# Altium schematic sheet Ethernet_PHY.SchDoc
size A2; SheetNumber: 11; SheetTotal: 14
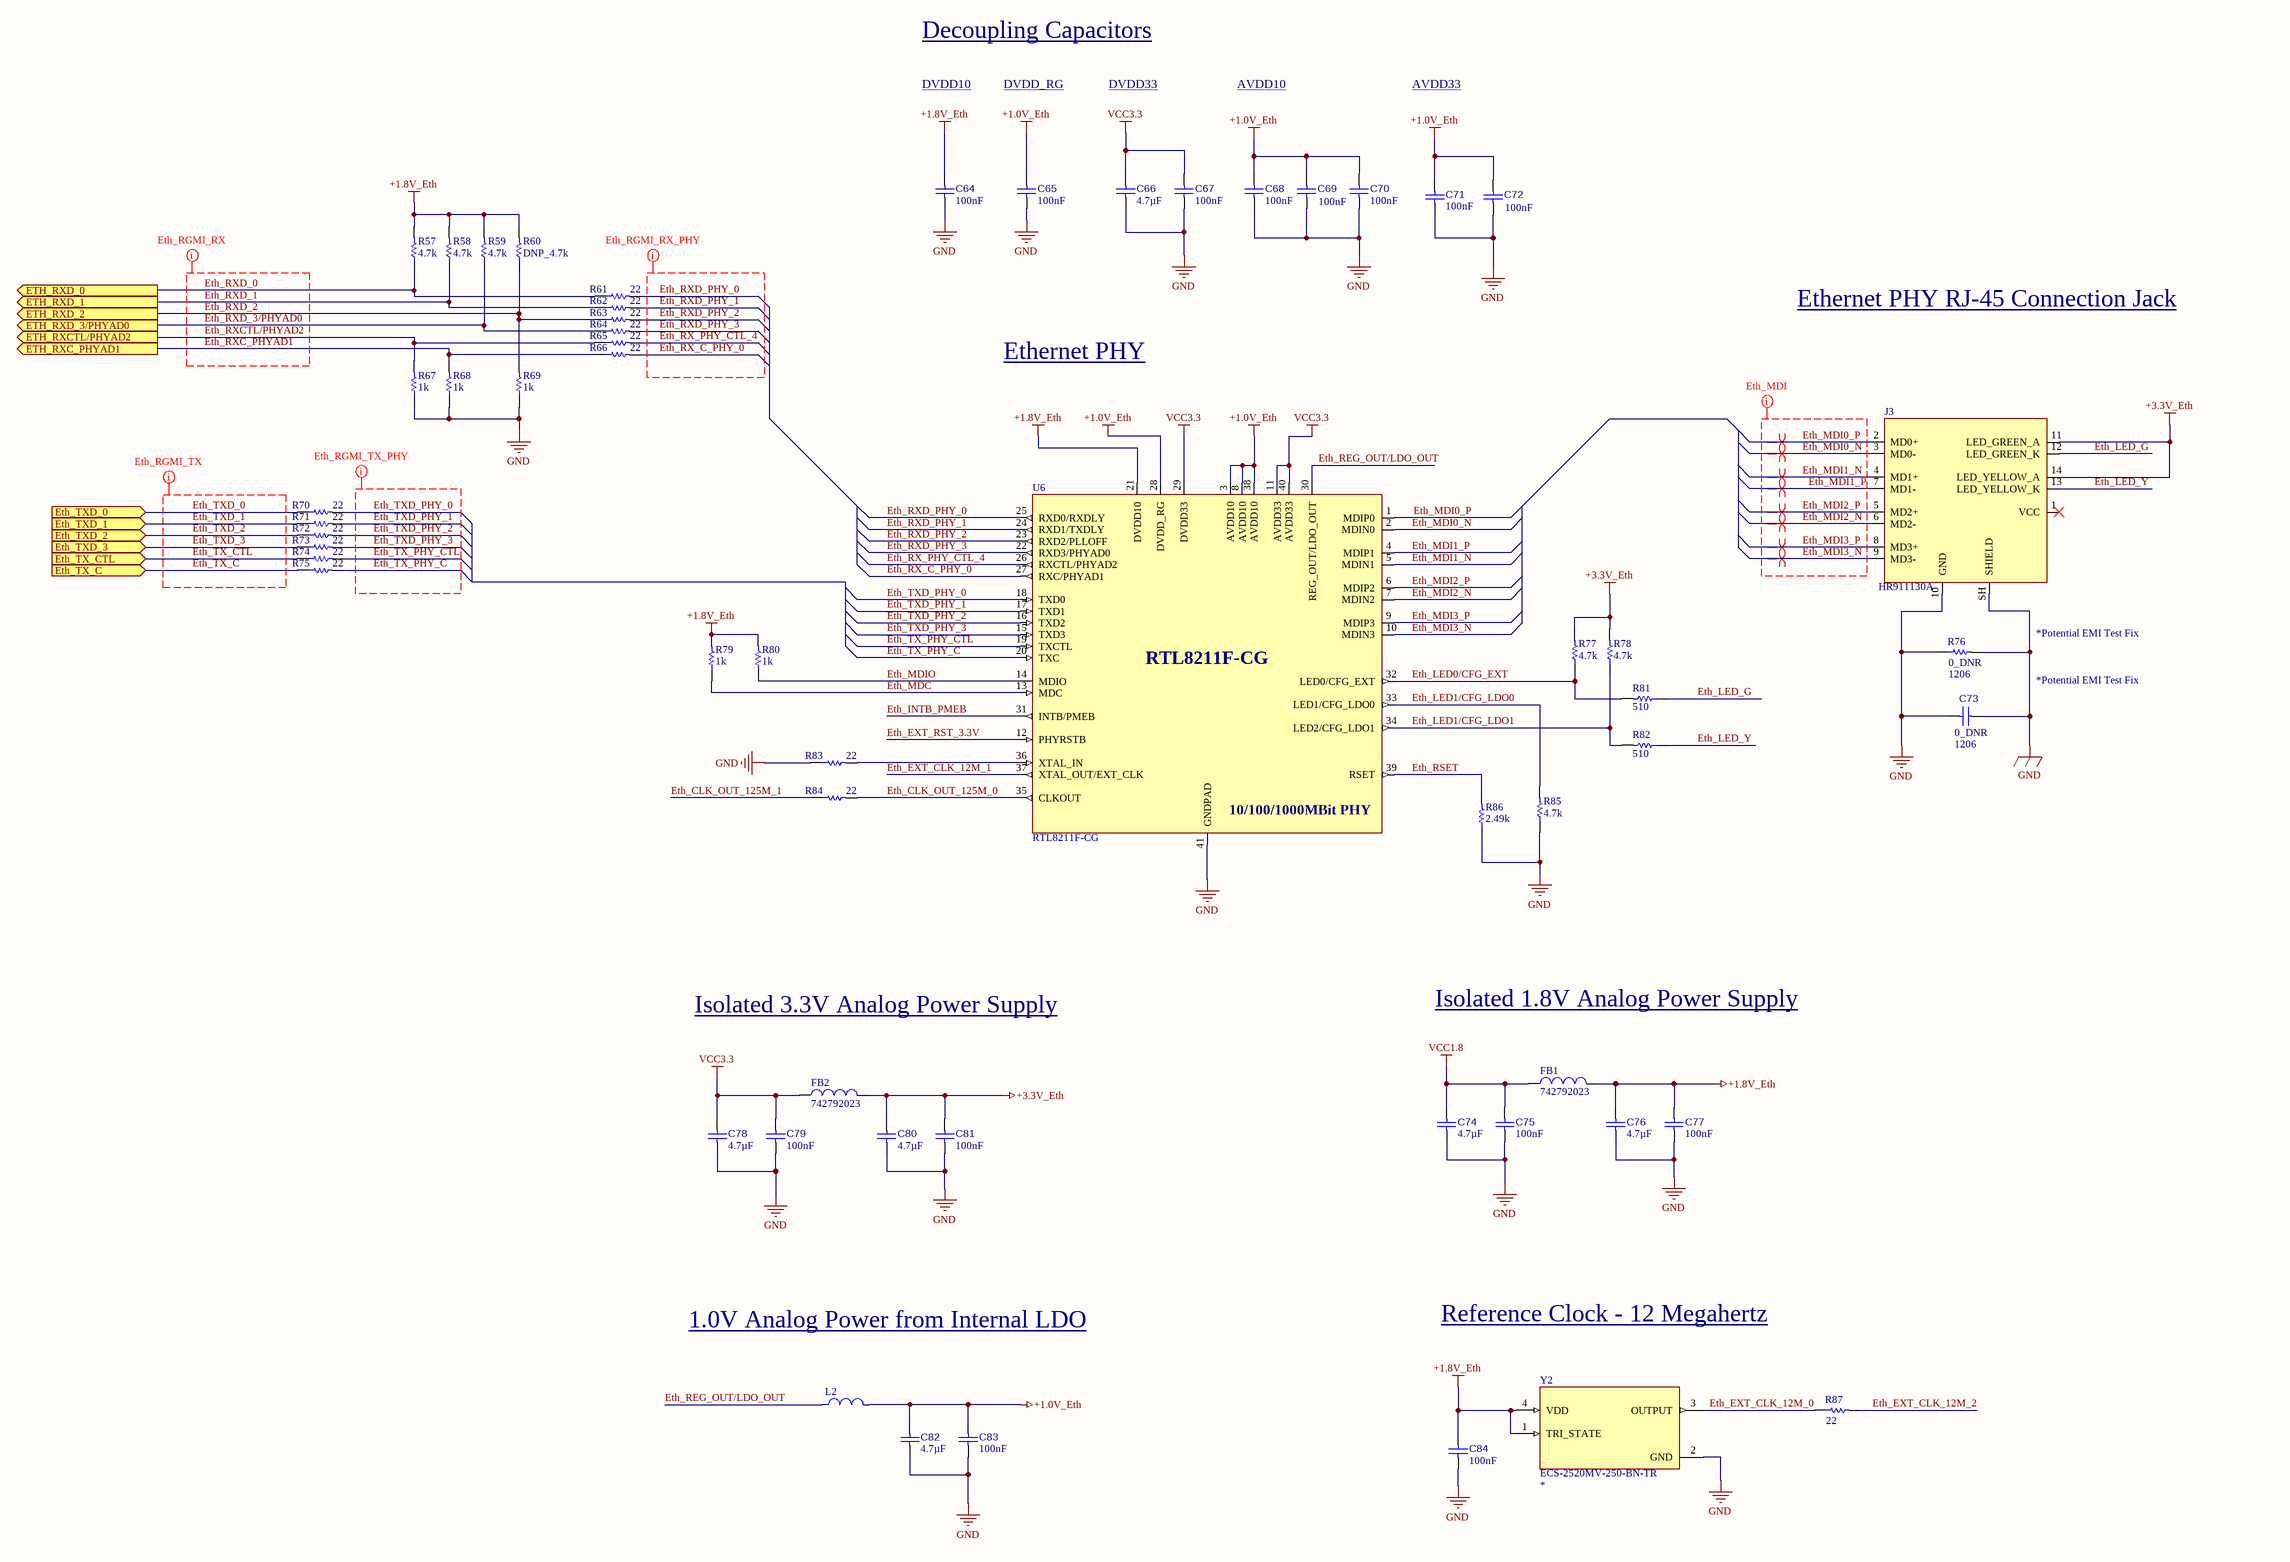
[diagram p0: Ethernet_PHY.SchDoc]

## Parts
C64  value 100nF  [CAPC1608X90X40NL10T20]  (hidden comment: Capacitor 100 nF +/-10% 50 V 0603)
C65  value 100nF  [CAPC1608X90X40NL10T20]  (hidden comment: Capacitor 100 nF +/-10% 50 V 0603)
C66  value 4.7µF  [CAPC0603(1608)100_L]  (hidden comment: Capacitor 4.7µF +/-20% 10V 0603)
C67  value 100nF  [CAPC1608X90X40NL10T20]  (hidden comment: Capacitor 100 nF +/-10% 50 V 0603)
C68  value 100nF  [CAPC1608X90X40NL10T20]  (hidden comment: Capacitor 100 nF +/-10% 50 V 0603)
C69  value 100nF  [CAPC1608X90X40NL10T20]  (hidden comment: Capacitor 100 nF +/-10% 50 V 0603)
C70  value 100nF  [CAPC1608X90X40NL10T20]  (hidden comment: Capacitor 100 nF +/-10% 50 V 0603)
C71  value 100nF  [CAPC1608X90X40NL10T20]  (hidden comment: Capacitor 100 nF +/-10% 50 V 0603)
C72  value 100nF  [CAPC1608X90X40NL10T20]  (hidden comment: Capacitor 100 nF +/-10% 50 V 0603)
C73  value 0_DNR  Case/Package: 1206  [CAPC3216X180X20ML20]  (hidden comment: Capacitor 1 uF +/- 10% 25 V 1206)
C74  value 4.7µF  [CAPC0603(1608)100_L]  (hidden comment: Capacitor 4.7µF +/-20% 10V 0603)
C75  value 100nF  [CAPC1608X90X40NL10T20]  (hidden comment: Capacitor 100 nF +/-10% 50 V 0603)
C76  value 4.7µF  [CAPC0603(1608)100_L]  (hidden comment: Capacitor 4.7µF +/-20% 10V 0603)
C77  value 100nF  [CAPC1608X90X40NL10T20]  (hidden comment: Capacitor 100 nF +/-10% 50 V 0603)
C78  value 4.7µF  [CAPC0603(1608)100_L]  (hidden comment: Capacitor 4.7µF +/-20% 10V 0603)
C79  value 100nF  [CAPC1608X90X40NL10T20]  (hidden comment: Capacitor 100 nF +/-10% 50 V 0603)
C80  value 4.7µF  [CAPC0603(1608)100_L]  (hidden comment: Capacitor 4.7µF +/-20% 10V 0603)
C81  value 100nF  [CAPC1608X90X40NL10T20]  (hidden comment: Capacitor 100 nF +/-10% 50 V 0603)
C82  value 4.7µF  [CAPC0603(1608)100_L]  (hidden comment: Capacitor 4.7µF +/-20% 10V 0603)
C83  value 100nF  [CAPC1608X90X40NL10T20]  (hidden comment: Capacitor 100 nF +/-10% 50 V 0603)
C84  value 100nF  [CAPC1608X90X40NL10T20]  (hidden comment: Capacitor 100 nF +/-10% 50 V 0603)
FB1  742792023  [WE-CBF_0805_L2W1.2H0.9_HC]
FB2  742792023  [WE-CBF_0805_L2W1.2H0.9_HC]
J3  HR911130A  [HR911130A]
L2  LQM18PN3R3MGHD  [FP-LQM18PN_GH-MFG]  (value not drawn)
R57  value 4.7k  [RESC1005X40X25ML05T05]  (hidden comment: Resistor 4k7 +/-1% 0402 100 mW)
R58  value 4.7k  [RESC1005X40X25ML05T05]  (hidden comment: Resistor 4k7 +/-1% 0402 100 mW)
R59  value 4.7k  [RESC1005X40X25ML05T05]  (hidden comment: Resistor 4k7 +/-1% 0402 100 mW)
R60  value DNP_4.7k  [RESC1005X40X25ML05T05]  (hidden comment: Resistor 4k7 +/-1% 0402 100 mW)  (net tie, no BOM)
R61  value 22  [RESC0402(1005)_L]  (hidden comment: Resistor 22R  +/-5 % 0402 63 mW)
R62  value 22  [RESC0402(1005)_L]  (hidden comment: Resistor 22R  +/-5 % 0402 63 mW)
R63  value 22  [RESC0402(1005)_L]  (hidden comment: Resistor 22R  +/-5 % 0402 63 mW)
R64  value 22  [RESC0402(1005)_L]  (hidden comment: Resistor 22R  +/-5 % 0402 63 mW)
R65  value 22  [RESC0402(1005)_L]  (hidden comment: Resistor 22R  +/-5 % 0402 63 mW)
R66  value 22  [RESC0402(1005)_L]  (hidden comment: Resistor 22R  +/-5 % 0402 63 mW)
R67  value 1k  [RESC1005X40X25ML05T05]  (hidden comment: Resistor 1k +/-1% 0402 100 mW)
R68  value 1k  [RESC1005X40X25ML05T05]  (hidden comment: Resistor 1k +/-1% 0402 100 mW)
R69  value 1k  [RESC1005X40X25ML05T05]  (hidden comment: Resistor 1k +/-1% 0402 100 mW)
R70  value 22  [RESC0402(1005)_L]  (hidden comment: Resistor 22R  +/-5 % 0402 63 mW)
R71  value 22  [RESC0402(1005)_L]  (hidden comment: Resistor 22R  +/-5 % 0402 63 mW)
R72  value 22  [RESC0402(1005)_L]  (hidden comment: Resistor 22R  +/-5 % 0402 63 mW)
R73  value 22  [RESC0402(1005)_L]  (hidden comment: Resistor 22R  +/-5 % 0402 63 mW)
R74  value 22  [RESC0402(1005)_L]  (hidden comment: Resistor 22R  +/-5 % 0402 63 mW)
R75  value 22  [RESC0402(1005)_L]  (hidden comment: Resistor 22R  +/-5 % 0402 63 mW)
R76  value 0_DNR  Case/Package: 1206  [RESC3116X70X50ML13T20]  (hidden comment: Resistor 0R +/- 0.05% 1206 250 mW)
R77  value 4.7k  [RESC1005X40X25ML05T05]  (hidden comment: Resistor 4k7 +/-1% 0402 100 mW)
R78  value 4.7k  [RESC1005X40X25ML05T05]  (hidden comment: Resistor 4k7 +/-1% 0402 100 mW)
R79  value 1k  [RESC1005X40X25ML05T05]  (hidden comment: Resistor 1k +/-1% 0402 100 mW)
R80  value 1k  [RESC1005X40X25ML05T05]  (hidden comment: Resistor 1k +/-1% 0402 100 mW)
R81  value 510  [RESC1005X40X25NL05T10]  (hidden comment: RC0402FR-07510RL)
R82  value 510  [RESC1005X40X25NL05T10]  (hidden comment: RC0402FR-07510RL)
R83  value 22  [RESC0402(1005)_L]  (hidden comment: Resistor 22R  +/-5 % 0402 63 mW)
R84  value 22  [RESC0402(1005)_L]  (hidden comment: Resistor 22R  +/-5 % 0402 63 mW)
R85  value 4.7k  [RESC1005X40X25ML05T05]  (hidden comment: Resistor 4k7 +/-1% 0402 100 mW)
R86  value 2.49k  [RESC1005X40X25NL05T10]  (hidden comment: RC0402FR-072K49L)
R87  value 22  [RESC0402(1005)_L]  (hidden comment: Resistor 22R  +/-5 % 0402 63 mW)
U6  RTL8211F-CG  [QFN-40-0.4-EP]
Y2  ECS-2520MV-250-BN-TR  [OSC_ECS-2520S25-250-FN-TR]

## Ports
ETH_RXC_PHYAD1 (out), ETH_RXCTL/PHYAD2 (out), ETH_RXD_0 (out), ETH_RXD_1 (out), ETH_RXD_2 (out), ETH_RXD_3/PHYAD0 (out), Eth_TX_C (in), Eth_TX_CTL (in), Eth_TXD_0 (in), Eth_TXD_1 (in), Eth_TXD_2 (in), Eth_TXD_3 (in)

## Nets
+1.0V_Eth: C65.2 C68.2 C69.2 C70.2 C71.2 C72.2 C82.2 C83.2 L2.2 U6.3(AVDD10) U6.8(AVDD10) U6.28(DVDD_RG) U6.38(AVDD10)
+1.8V_Eth: C64.2 C76.2 C77.2 C84.2 FB1.2 R57.2 R58.2 R59.2 R60.2 R79.2 R80.2 U6.21(DVDD10) Y2.1(TRI_STATE) Y2.4(VDD)
+3.3V_Eth: C80.2 C81.2 FB2.2 J3.11(LED_GREEN_A) J3.14(LED_YELLOW_A) R77.2 R78.2
GND: C64.1 C65.1 C66.1 C67.1 C68.1 C69.1 C70.1 C71.1 C72.1 C73.1 C73.2 C74.1 C75.1 C76.1 C77.1 C78.1 C79.1 C80.1 C81.1 C82.1 C83.1 C84.1 J3.10(GND) J3.SH(SHIELD) R67.1 R68.1 R69.1 R76.1 R76.2 R83.1 R85.1 R86.1 U6.41(GNDPAD) Y2.2(GND)
VCC1.8: C74.2 C75.2 FB1.1
VCC3.3: C66.2 C67.2 C78.2 C79.2 FB2.1 U6.11(AVDD33) U6.29(DVDD33) U6.40(AVDD33)
Eth_CLK_OUT_125M_0: R84.2 U6.35(CLKOUT)
Eth_CLK_OUT_125M_1: R84.1
Eth_EXT_CLK_12M_0: R87.1 Y2.3(OUTPUT)
Eth_EXT_CLK_12M_1: U6.37(XTAL_OUT/EXT_CLK)
Eth_EXT_CLK_12M_2: R87.2
Eth_EXT_RST_3.3V: U6.12(PHYRSTB)
Eth_INTB_PMEB: U6.31(INTB/PMEB)
Eth_LED0/CFG_EXT: R77.1 R81.2 U6.32(LED0/CFG_EXT)
Eth_LED1/CFG_LDO0: R85.2 U6.33(LED1/CFG_LDO0)
Eth_LED1/CFG_LDO1: R78.1 R82.2 U6.34(LED2/CFG_LDO1)
Eth_LED_G: J3.12(LED_GREEN_K) R81.1
Eth_LED_Y: J3.13(LED_YELLOW_K) R82.1
Eth_MDC: R79.1 U6.13(MDC)
Eth_MDI0_N: J3.3(MD0-) U6.2(MDIN0)
Eth_MDI0_P: J3.2(MD0+) U6.1(MDIP0)
Eth_MDI1_N: J3.4(MD1+) U6.5(MDIN1)
Eth_MDI1_P: J3.7(MD1-) U6.4(MDIP1)
Eth_MDI2_N: J3.6(MD2-) U6.7(MDIN2)
Eth_MDI2_P: J3.5(MD2+) U6.6(MDIP2)
Eth_MDI3_N: J3.9(MD3-) U6.10(MDIN3)
Eth_MDI3_P: J3.8(MD3+) U6.9(MDIP3)
Eth_MDIO: R80.1 U6.14(MDIO)
Eth_REG_OUT/LDO_OUT: L2.1 U6.30(REG_OUT/LDO_OUT)
Eth_RSET: R86.2 U6.39(RSET)
Eth_RX_C_PHY_0: R66.2 U6.27(RXC/PHYAD1)
Eth_RX_PHY_CTL_4: R65.2 U6.26(RXCTL/PHYAD2)
Eth_RXC_PHYAD1: R66.1 R68.2 ; port ETH_RXC_PHYAD1
Eth_RXCTL/PHYAD2: R65.1 R67.2 ; port ETH_RXCTL/PHYAD2
Eth_RXD_0: R57.1 R61.1 ; port ETH_RXD_0
Eth_RXD_1: R58.1 R62.1 ; port ETH_RXD_1
Eth_RXD_2: R60.1 R63.1 R69.2 ; port ETH_RXD_2
Eth_RXD_3/PHYAD0: R59.1 R64.1 ; port ETH_RXD_3/PHYAD0
Eth_RXD_PHY_0: R61.2 U6.25(RXD0/RXDLY)
Eth_RXD_PHY_1: R62.2 U6.24(RXD1/TXDLY)
Eth_RXD_PHY_2: R63.2 U6.23(RXD2/PLLOFF)
Eth_RXD_PHY_3: R64.2 U6.22(RXD3/PHYAD0)
Eth_TX_C: R75.1 ; port Eth_TX_C
Eth_TX_CTL: R74.1 ; port Eth_TX_CTL
Eth_TX_PHY_C: R75.2 U6.20(TXC)
Eth_TX_PHY_CTL: R74.2 U6.19(TXCTL)
Eth_TXD_0: R70.1 ; port Eth_TXD_0
Eth_TXD_1: R71.1 ; port Eth_TXD_1
Eth_TXD_2: R72.1 ; port Eth_TXD_2
Eth_TXD_3: R73.1 ; port Eth_TXD_3
Eth_TXD_PHY_0: R70.2 U6.18(TXD0)
Eth_TXD_PHY_1: R71.2 U6.17(TXD1)
Eth_TXD_PHY_2: R72.2 U6.16(TXD2)
Eth_TXD_PHY_3: R73.2 U6.15(TXD3)
NetR83_2: R83.2 U6.36(XTAL_IN)

Not connected (* = marked no-connect by the designer): J3 1(VCC)*

## Layout directives
net class Ethernet RGMI Rx PHY: Eth_RX_C_PHY_0, Eth_RX_PHY_CTL_4, Eth_RXD_PHY_0, Eth_RXD_PHY_1, Eth_RXD_PHY_2, Eth_RXD_PHY_3
net class Ethernet RGMI Tx PHY: Eth_TX_PHY_C, Eth_TX_PHY_CTL, Eth_TXD_PHY_0, Eth_TXD_PHY_1, Eth_TXD_PHY_2, Eth_TXD_PHY_3
net class Ethernet MDI: Eth_MDI0_N, Eth_MDI0_P, Eth_MDI1_N, Eth_MDI1_P, Eth_MDI2_N, Eth_MDI2_P, Eth_MDI3_N, Eth_MDI3_P
net class Ethernet RGMI TX: Eth_TX_C, Eth_TX_CTL, Eth_TXD_0, Eth_TXD_1, Eth_TXD_2, Eth_TXD_3
net class Ethernet RGMI Rx: Eth_RXC_PHYAD1, Eth_RXCTL/PHYAD2, Eth_RXD_0, Eth_RXD_1, Eth_RXD_2, Eth_RXD_3/PHYAD0
differential pair: Eth_MDI0_N, Eth_MDI0_P, Eth_MDI1_N, Eth_MDI1_P, Eth_MDI2_N, Eth_MDI2_P, Eth_MDI3_N, Eth_MDI3_P

## Notes on the sheet
- Decoupling Capacitors
- DVDD10
- DVDD_RG
- DVDD33
- AVDD10
- AVDD33
- Ethernet PHY
- Ethernet PHY RJ-45 Connection Jack
- *Potential EMI Test Fix
- Isolated 3.3V Analog Power Supply
- Isolated 1.8V Analog Power Supply
- 1.0V Analog Power from Internal LDO
- Reference Clock - 12 Megahertz
- (in symbol CMP-049-000049-1) 10/100/1000MBit PHY

## Library data of the parts
C64 C65 C67-C72 C75 C77 C79 C81 C83 C84 = CMP-001-00017-7: Chip Capacitor, 100 nF, +/- 10%, 50 V, 0603 (1608 Metric); Voltage Rating: 50V; Capacitor Type: Ceramic; Mounting Technology: SM; Pins: 2; Tolerance: 10%; Case/Package: 0603; Max Operating Temperature: 125°C; Min Operating Temperature: -55°C; RoHS Compliant: True
C66 C74 C76 C78 C80 C82 = CMP-001-00076-5: Chip Capacitor, 4.7µF +/-20%, 10V, 0603, Thickness 1 mm; Tolerance: 10%; Max Operating Temperature: 85°C; Min Operating Temperature: -55°C; Voltage Rating: 10V; Pins: 2; Mounting Technology: SMT; Case/Package: 0603
C73 = CMP-001-00006-7: Chip Capacitor, 1 uF, +/- 10%, 25 V, 1206 (3216 Metric); Voltage Rating: 25V; Capacitor Type: Ceramic; Mounting Technology: SM; Max Operating Temperature: 125°C; RoHS Compliant: True; Tolerance: 10%; Pins: 2; Min Operating Temperature: -55°C
FB1 FB2 = CMP-0220-00030-2: NexarPartId: 8916989; Manufacturer: Wurth Electronics; Number of Lines: 1; Impedance: 120Ω; Max Current Rating: 3A; Tolerance: 25%; Resistance: 30mΩ; Shielding: Unshielded; Inductance: 1H; Test Frequency: 100MHz; DC Resistance-Max: 30mR; Filter Type: FERRITE CHIP; Clock Frequency: 250MHz; Output Impedance: 120R; Height: 900µm; REACH SVHC: Unknown; Termination: SMD/SMT; Weight: 10.999615mg; Max Operating Temperature: 125°C; Length: 2mm; Min Operating Temperature: -55°C; Case Code (Imperial): 0805; Core Material: Ferrite; Current Rating: 3A; Lead Free: Lead Free; Mount: Surface Mount; Width: 1.2mm; Case Code (Metric): 2012; RoHS: Compliant; Case/Package: SMD/SMT; Max DC Current: 3A; Depth: 1.2mm; Packaging: Cut Tape (CT); DC Resistance (DCR): 30mΩ; Supplier: Newark; Supplier Part Number: 24AC5582; Manufacturer Part Number: 742792023; Category: Ferrite Beads and Chips; Stock: 8000; Pricing: 4000=0.17 (USD); Mounting Technology: Surface Mount; Material: Ferrite; Case Code: 0805; Terminal Finish: Nickel; Min Frequency: 100MHz; Channels: 1; JESD-609 Code: e3; Construction: Multi-Layer; Reach SVHC Compliant: Yes; RoHS Compliant: Yes; ComponentLink1URL: https://datasheet.ciiva.com:443/pdfs/VipMasterIC/IC/MIDC/MIDC-S-A0008919821/MIDC-S-A0008918329-1.pdf?src-supplier=IHS+Markit; ComponentLink1Description: https://datasheet.ciiva.com:443/pdfs/VipMasterIC/IC/MIDC/MIDC-S-A0008919821/MIDC-S-A0008918329-1.pdf?src-supplier=IHS+Markit; ComponentLink2URL: https://datasheet.ciiva.com/1013/742792023-1013536.pdf?src-supplier=Digikey; ComponentLink2Description: https://datasheet.ciiva.com/1013/742792023-1013536.pdf?src-supplier=Digikey; ComponentLink3URL: https://datasheet.ciiva.com/4940/742792023-80959-4940415.pdf?src-supplier=Mouser; ComponentLink3Description: https://datasheet.ciiva.com/4940/742792023-80959-4940415.pdf?src-supplier=Mouser; ComponentLink4URL: https://datasheet.ciiva.com/11803/0900766b80bbd134-11803678.pdf?src-supplier=Rs; ComponentLink4Description: https://datasheet.ciiva.com/11803/0900766b80bbd134-11803678.pdf?src-supplier=Rs; ComponentLink5URL: https://datasheet.ciiva.com/1126/1695980-1126531.pdf?src-supplier=Element14; ComponentLink5Description: https://datasheet.ciiva.com/1126/1695980-1126531.pdf?src-supplier=Element14; ComponentLink6URL: https://datasheet.ciiva.com/6739/742792023-6739069.pdf?src-supplier=Newark; ComponentLink6Description: https://datasheet.ciiva.com/6739/742792023-6739069.pdf?src-supplier=Newark; ComponentLink7URL: https://datasheet.ciiva.com/1013/742792023-1013537.pdf?src-supplier=Digikey; ComponentLink7Description: https://datasheet.ciiva.com/1013/742792023-1013537.pdf?src-supplier=Digikey; ComponentLink8URL: https://datasheet.ciiva.com/1013/742792023-1013538.pdf?src-supplier=Digikey; ComponentLink8Description: https://datasheet.ciiva.com/1013/742792023-1013538.pdf?src-supplier=Digikey; ComponentLink9URL: https://datasheet.ciiva.com/48698/001086956-da-01-ml-we-cbf-smd-ferrit-742792023-de-en-48698517.pdf?src-supplier=Conrad; ComponentLink9Description: https://datasheet.ciiva.com/48698/001086956-da-01-ml-we-cbf-smd-ferrit-742792023-de-en-48698517.pdf?src-supplier=Conrad
J3 = CMP-002-00088-1: 100/1000Base-T Magnetics Single-Port RJ45 Connector with Integrated Magnetics and LEDs; Manufacturer: Hanrun; Manufacturer Part Number: HR911130A; Source: Schematic-Lib-PhilsLab.SchLib; Design Item ID: HR911130A
L2 = CMP-006-00047-1: General Purpose Inductor, 3.3uH, 20%, 1 Element, Ferrite-Core, SMD, 0603; Max Current Rating: 1.05A; Self Resonant Frequency: 30MHz; RoHS Compliant: Yes; Max Operating Temperature: 85°C; Min Operating Temperature: -40°C; Pins: 2; Tolerance: 20%
R57-R60 R77 R78 R85 = CMP-009-00030-6: Chip Resistor, 4.7 KOhm, +/- 1%, 0.1 W, -55 to 155 degC, 0402 (1005 Metric); Voltage Rating: 50V; Power: 100mW; Max Operating Temperature: 155°C; RoHS Compliant: True; Min Operating Temperature: -55°C; Pins: 2; Tolerance: 1%; Mounting Technology: SM; Case/Package: 0402
R61-R66 R70-R75 R83 R84 R87 = CMP-009-00164-4: Chip Resistor, 22 Ohms, +/-5 %, 63 mW, -55 to 155 degC, 0402; Power: 63mW; Tolerance: 5%; Max Operating Temperature: 155°C; Pins: 2; Min Operating Temperature: -55°C; Case/Package: 0402
R67-R69 R79 R80 = CMP-009-00009-5: Chip Resistor, 1 KOhm, +/- 1%, 0.1 W, -55 to 155 degC, 0402 (1005 Metric); Power: 100mW; Voltage Rating: 50V; Min Operating Temperature: -55°C; Max Operating Temperature: 155°C; RoHS Compliant: True; Mounting Technology: SM; Pins: 2; Tolerance: 1%; Case/Package: 0402
R76 = CMP-009-00008-6: Chip Resistor, 0 Ohm, 0.25 W, -55 to 155 degC, 1206 (3216 Metric); Voltage Rating: 200V; Power: 0_DNR; RoHS Compliant: True; Max Operating Temperature: 155°C; Mounting Technology: SM; Min Operating Temperature: -55°C; Tolerance: 0.05%; Pins: 2
R81 R82 = CMP-009-00202-1: Fixed Resistor, Metal Glaze/thick Film, 0.0625W, 510ohm, 50V, 1% +/-Tol, 100ppm/Cel, Surface Mount, 0402; Power: 62.5mW; Pins: 2; Max Operating Temperature: 155°C; Case/Package: 0402; Tolerance: 1%; Min Operating Temperature: -55°C; RoHS Compliant: Yes; Mounting Technology: Surface Mount
R86 = CMP-009-00200-1: Fixed Resistor, Metal Glaze/thick Film, 0.0625W, 2490ohm, 50V, 1% +/-Tol, 100ppm/Cel, Surface Mount, 0402; Power: 62.5mW; Case/Package: 0402; Pins: 2; Mounting Technology: Surface Mount; Tolerance: 1%; Max Operating Temperature: 155°C; Min Operating Temperature: -55°C; RoHS Compliant: Yes
U6 = CMP-049-000049-1: INTEGRATED 10/100/1000M ETHERNET PRECISION TRANSCEIVER; Manufacturer: Realtek; Manufacturer Part Number: RTL8211F-CG; Design Item ID: RTL8211F-CG; Source: Schematic-Lib-PhilsLab.SchLib
Y2 = CMP-029-000000-1: 25 MHz XO (Standard) HCMOS Oscillator 1.6V ~ 3.6V Enable/Disable 4-SMD, No Lead; MF: ECS Inc.; Design Item ID: ECS-2520MV-250-BN-TR; MP: ECS-2520MV-250-BN-TR; Component Type: Standard; Value: *; SnapEDA_Link: https://www.snapeda.com/parts/ECS-2520MV-250-BN-TR/ECS/view-part/?ref=snap; Pin Count: 4; Source: ECS-2520MV-250-BN-TR.SchLib; Check_prices: https://www.snapeda.com/parts/ECS-2520MV-250-BN-TR/ECS/view-part/?ref=eda; Package: ECS-2520MV-0-4 ECS